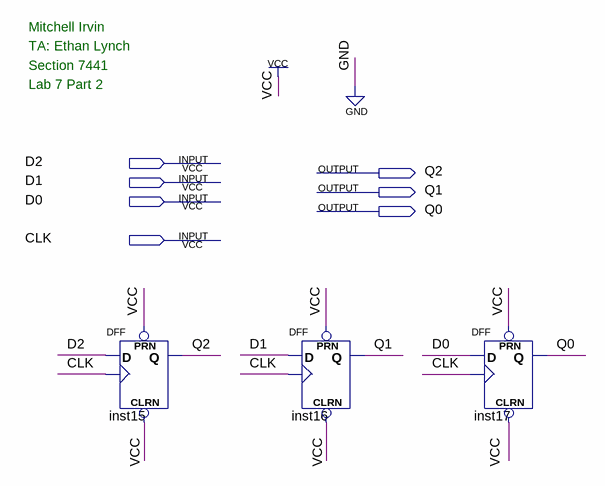
[diagram p0: schematic sheet]
// Quartus schematic part3.bdf as structural Verilog: 3 symbols, 7 pins
module part3 (
  input  D2,
  input  D1,
  input  D0,
  input  CLK,
  output Q2,
  output Q1,
  output Q0
);

  DFF inst15 (.CLRN(1'b1), .CLK(CLK), .D(D2), .PRN(1'b1), .Q(Q2));
  DFF inst16 (.CLRN(1'b1), .CLK(CLK), .D(D1), .PRN(1'b1), .Q(Q1));
  DFF inst17 (.CLRN(1'b1), .CLK(CLK), .D(D0), .PRN(1'b1), .Q(Q0));

  // Notes on the sheet:
  //   Mitchell Irvin
  //   TA: Ethan Lynch
  //   Section 7441
  //   Lab 7 Part 2
endmodule
